# Altium schematic sheet FM349readerV01.SchDoc
size A3
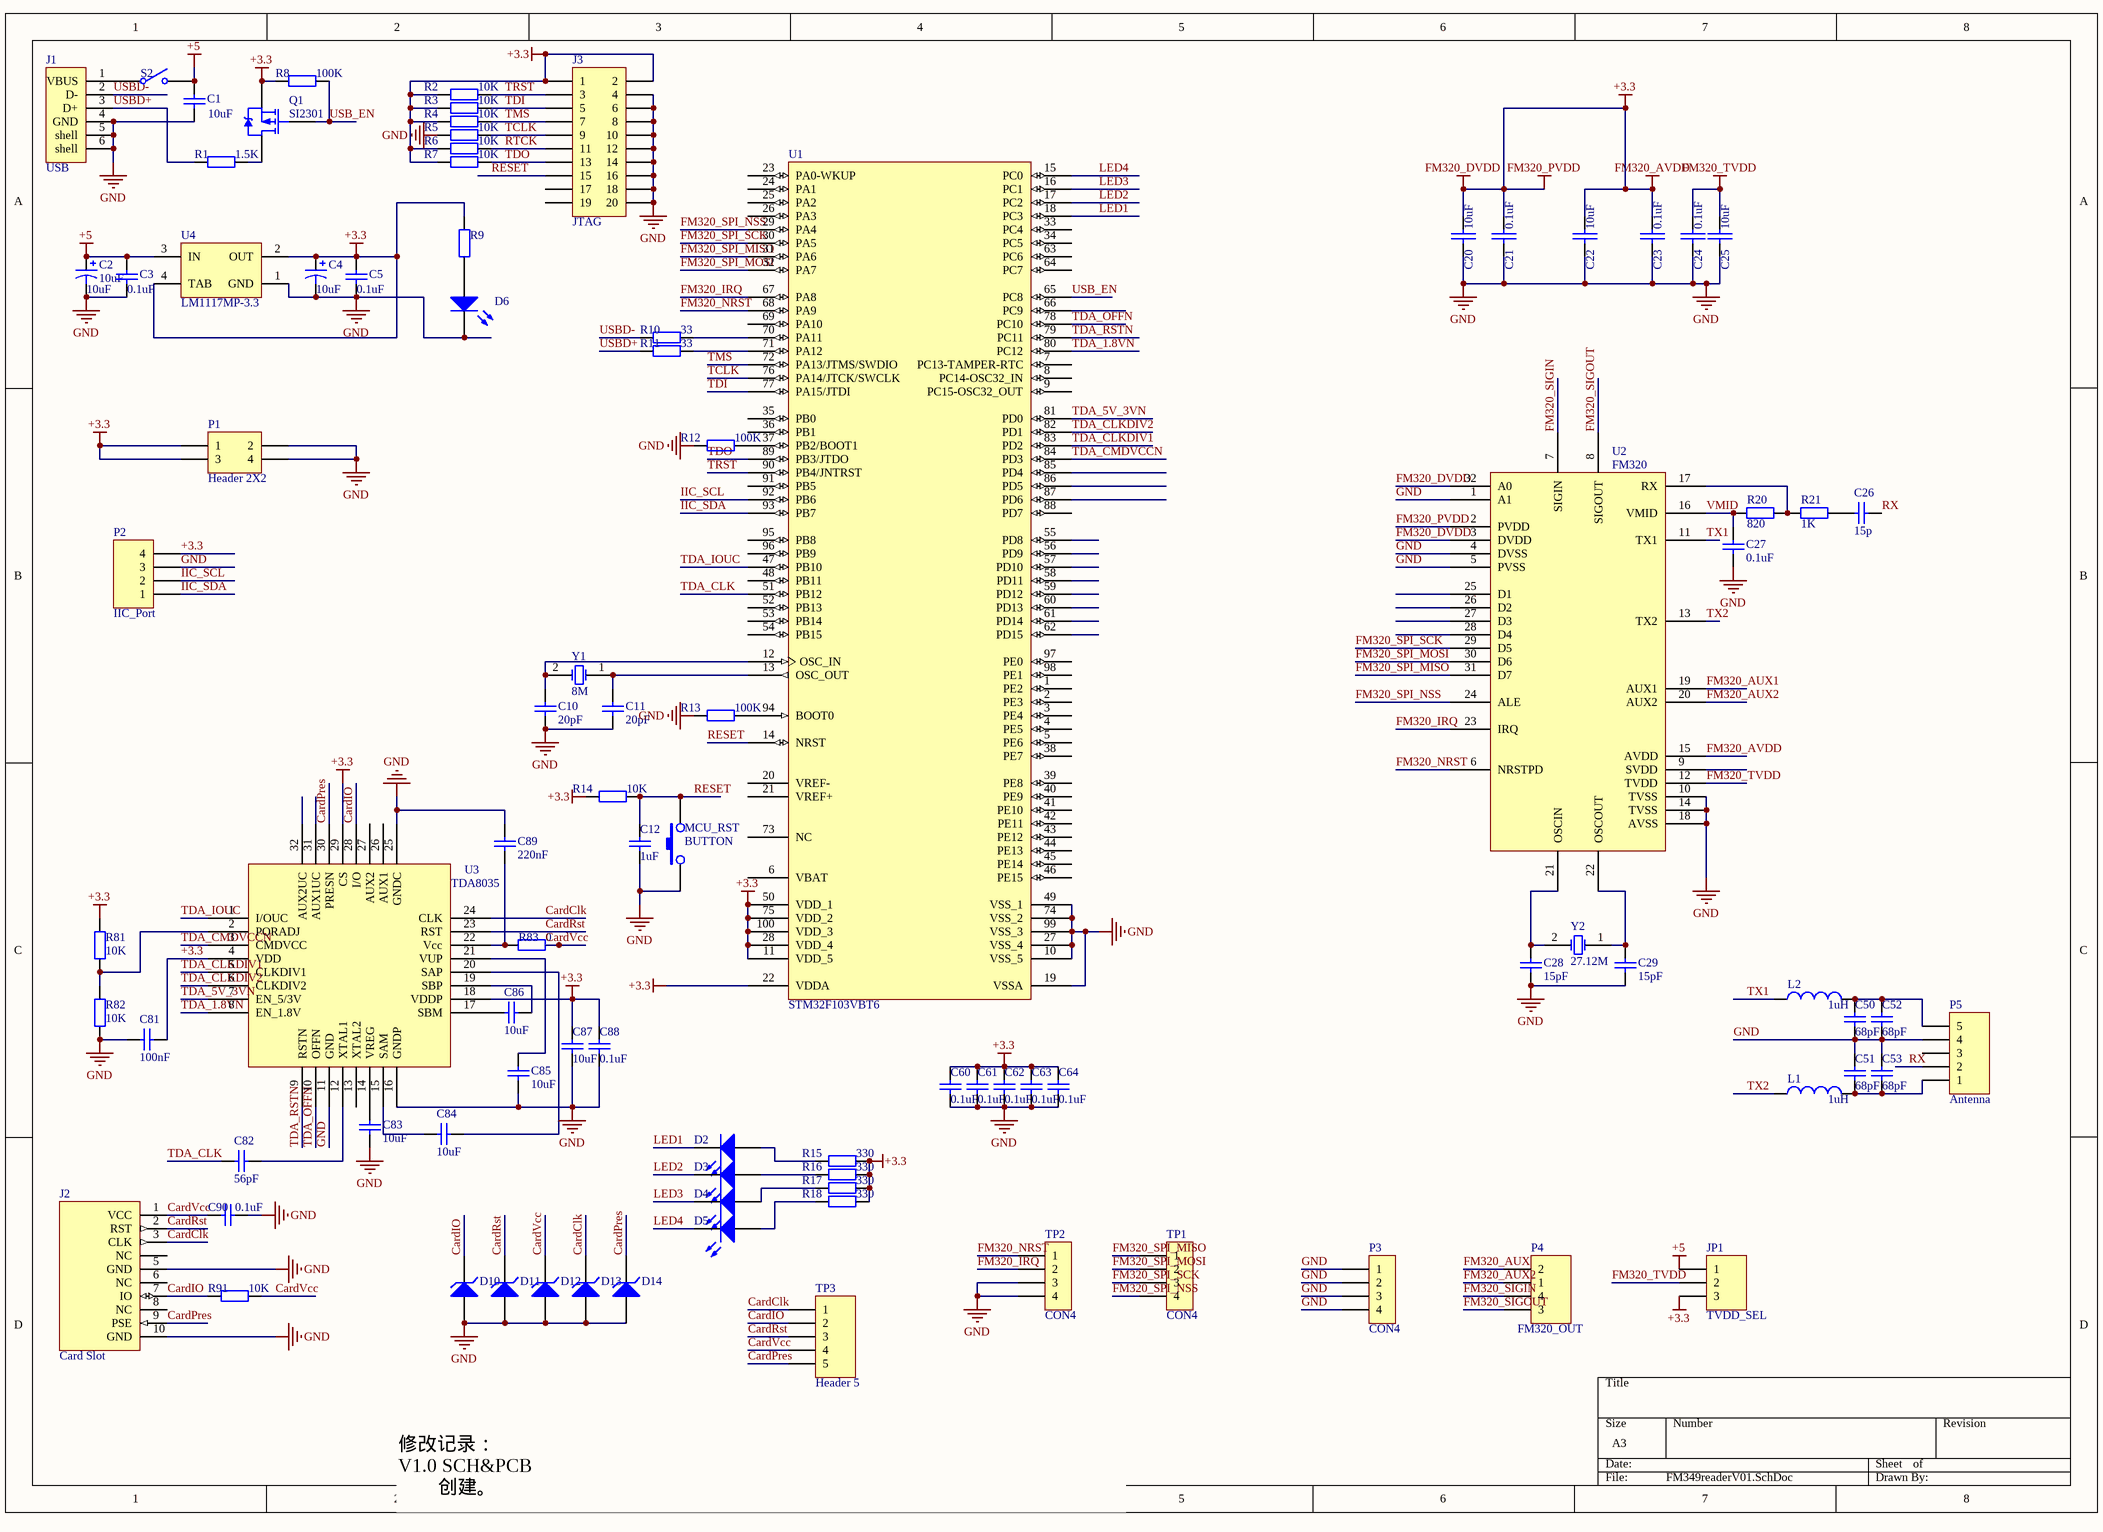
[diagram p0: FM349readerV01.SchDoc]

## Parts
C1  10uF  [0805]
C2  10uF  [0805]
C3  0.1uF  [0805]
C4  10uF  [0805]
C5  0.1uF  [0805]
C10  20pF  [0805]
C11  20pF  [0805]
C12  1uF  [0805]
C20  10uF  [0805]
C21  0.1uF  [0805]
C22  10uF  [0805]
C23  0.1uF  [0805]
C24  0.1uF  [0805]
C25  10uF  [0805]
C26  value 15p  [0805]  (hidden comment: 0.1uF)
C27  0.1uF  [0805]
C28  15pF  [0805]
C29  15pF  [0805]
C50  68pF  [0805]
C51  68pF  [0805]
C52  68pF  [0805]
C53  68pF  [0805]
C60  0.1uF  [0805]
C61  0.1uF  [0805]
C62  0.1uF  [0805]
C63  0.1uF  [0805]
C64  0.1uF  [0805]
C81  value 100nF  [0805]  (hidden comment: 0.1uF)
C82  value 56pF  [0805]  (hidden comment: 0.1uF)
C83  value 10uF  [0805]  (hidden comment: 0.1uF)
C84  value 10uF  [0805]  (hidden comment: 0.1uF)
C85  value 10uF  [0805]  (hidden comment: 0.1uF)
C86  value 10uF  [0805]  (hidden comment: 0.1uF)
C87  value 10uF  [0805]  (hidden comment: 0.1uF)
C88  0.1uF  [0805]
C89  value 220nF  [0805]  (hidden comment: 0.1uF)
C90  0.1uF  [0805]
D2  LED2  [3.2X1.6X1.1]  (value not drawn)
D3  LED2  [3.2X1.6X1.1]  (value not drawn)
D4  LED2  [3.2X1.6X1.1]  (value not drawn)
D5  LED2  [3.2X1.6X1.1]  (value not drawn)
D6  LED2  [3.2X1.6X1.1]  (value not drawn)
D10  ESD  [SOD-323]  (value not drawn)
D11  ESD  [SOD-323]  (value not drawn)
D12  ESD  [SOD-323]  (value not drawn)
D13  ESD  [SOD-323]  (value not drawn)
D14  ESD  [SOD-323]  (value not drawn)
J1  USB  [USB-B]
J2  Card Slot  [BIG-CARD-SLOT]
J3  JTAG  [HDR2X10]
JP1  TVDD_SEL  [HDR1X3]
L1  1uH  [1812]
L2  1uH  [1812]
MCU_RST  BUTTON  [BUTTON-S]
P1  Header 2X2  [HDR2X2]
P2  IIC_Port  [HDR1X4]
P3  CON4  [HDR1X4]
P4  FM320_OUT  [HDR1X4]
P5  Antenna  [HDR1X5]
Q1  SI2301  [SOT-23-2301]
R1  1.5K  [0805]
R2  10K  [0805]
R3  10K  [0805]
R4  10K  [0805]
R5  10K  [0805]
R6  10K  [0805]
R7  10K  [0805]
R8  value 100K  [0805]  (hidden comment: 10K)
R9  1.5K  [0805]  (value not drawn)
R10  33  [0805]
R11  33  [0805]
R12  100K  [0805]
R13  100K  [0805]
R14  10K  [0805]
R15  330  [0805]
R16  330  [0805]
R17  330  [0805]
R18  330  [0805]
R20  820  [0805]
R21  1K  [0805]
R81  value 10K  [0805]  (hidden comment: 1.5K)
R82  value 10K  [0805]  (hidden comment: 1.5K)
R83  value 0  [0805]  (hidden comment: 10K)
R91  value 10K  [0805]  (hidden comment: 1.5K)
S2  SW-SPST  [SW]  (value not drawn)
TP1  CON4  [HDR1X4]
TP2  CON4  [HDR1X4]
TP3  Header 5  [HDR1X5]
U1  STM32F103VBT6  [LQFP100_L]
U2  FM320  [FM320_PIN32]
U3  TDA8035  [TDA8035_PIN32]
U4  LM1117MP-3.3  [MP04A_L]
Y1  8M  [XTAL-0.2]
Y2  27.12M  [XTAL-0.2]

## Nets
+3.3: C4.1 C5.2 C20.2 C21.1 C22.1 C23.1 C60.2 C61.2 C62.2 C63.2 C64.2 C81.1 C87.2 C88.2 J3.1 J3.2 JP1.3 P1.1 P1.3 P2.4 Q1.3(S) R2.1 R3.1 R4.1 R6.1 R7.1 R8.1 R9.2 R14.1 R15.2 R16.1 R17.2 R18.2 R81.2 U1.11(VDD_5) U1.22(VDDA) U1.28(VDD_4) U1.50(VDD_1) U1.75(VDD_2) U1.100(VDD_3) U2.2(PVDD) U2.3(DVDD) U2.15(AVDD) U2.32(A0) U3.4(VDD) U3.18(VDDP) U3.29(CS) U4.2(OUT) U4.4(TAB)  [also labelled FM320_AVDD, FM320_DVDD, FM320_PVDD]
+5: C1.2 C2.1 C3.2 JP1.1 S2.2(NO) U4.3(IN)
FM320_TVDD: C24.1 C25.1 JP1.2 U2.12(TVDD)
GND: C1.1 C2.2 C3.1 C4.2 C5.1 C10.1 C11.1 C12.1 C20.1 C21.2 C22.2 C23.2 C24.2 C25.2 C27.2 C28.1 C29.1 C50.2 C51.1 C52.2 C53.1 C60.1 C61.1 C62.1 C63.1 C64.1 C81.2 C83.2 C85.1 C87.1 C88.1 C89.1 C90.2 D6.2(K) D10.1(A) D11.1(A) D12.1(A) D13.1(A) D14.1(A) J1.4(GND) J1.5(shell) J1.6(shell) J2.5(GND) J2.10(GND) J3.4 J3.6 J3.8 J3.10 J3.12 J3.14 J3.16 J3.18 J3.20 MCU_RST.1 P1.2 P1.4 P2.3 P3.1 P3.2 P3.3 P3.4 P5.4 R5.2 R12.1 R13.1 R82.1 TP2.3 TP2.4 U1.10(VSS_5) U1.19(VSSA) U1.27(VSS_4) U1.49(VSS_1) U1.74(VSS_2) U1.99(VSS_3) U2.1(A1) U2.4(DVSS) U2.5(PVSS) U2.10(TVSS) U2.14(TVSS) U2.18(AVSS) U3.11(GND) U3.16(GNDP) U3.25(GNDC) U4.1(GND)
CardClk: D13.2(K) J2.3(CLK) TP3.1 U3.24(CLK)
CardIO: D10.2(K) J2.7(IO) R91.1 TP3.2 U3.28(I/O)
CardPres: D14.2(K) J2.9(PSE) TP3.5 U3.30(PRESN)
CardRst: D11.2(K) J2.2(RST) TP3.3 U3.23(RST)
CardVcc: C90.1 D12.2(K) J2.1(VCC) R83.2 R91.2 TP3.4
FM320_AUX1: P4.2 U2.19(AUX1)
FM320_AUX2: P4.1 U2.20(AUX2)
FM320_IRQ: TP2.2 U1.67(PA8) U2.23(IRQ)
FM320_NRST: TP2.1 U1.68(PA9) U2.6(NRSTPD)
FM320_SIGIN: P4.4 U2.7(SIGIN)
FM320_SIGOUT: P4.3 U2.8(SIGOUT)
FM320_SPI_MISO: TP1.1 U1.31(PA6) U2.31(D7)
FM320_SPI_MOSI: TP1.2 U1.32(PA7) U2.30(D6)
FM320_SPI_NSS: TP1.4 U1.29(PA4) U2.24(ALE)
FM320_SPI_SCK: TP1.3 U1.30(PA5) U2.29(D5)
IIC_SCL: P2.2 U1.92(PB6)
IIC_SDA: P2.1 U1.93(PB7)
LED1: D2.2(K) U1.18(PC3)
LED2: D3.2(K) U1.17(PC2)
LED3: D4.2(K) U1.16(PC1)
LED4: D5.2(K) U1.15(PC0)
RESET: C12.2 J3.15 MCU_RST.2 R14.2 U1.14(NRST)
RTCK: J3.11 R6.2
RX: C26.1 P5.2
TCLK: J3.9 R5.1 U1.76(PA14/JTCK/SWCLK)
TDA_1.8VN: U1.80(PC12) U3.8(EN_1.8V)
TDA_5V_3VN: U1.81(PD0) U3.7(EN_5/3V)
TDA_CLK: C82.1 U1.51(PB12)
TDA_CLKDIV1: U1.83(PD2) U3.5(CLKDIV1)
TDA_CLKDIV2: U1.82(PD1) U3.6(CLKDIV2)
TDA_CMDVCCN: U1.84(PD3) U3.3(CMDVCC)
TDA_IOUC: U1.47(PB10) U3.1(I/OUC)
TDA_OFFN: U1.78(PC10) U3.10(OFFN)
TDA_RSTN: U1.79(PC11) U3.9(RSTN)
TDI: J3.5 R3.2 U1.77(PA15/JTDI)
TDO: J3.13 R7.2 U1.89(PB3/JTDO)
TMS: J3.7 R4.2 U1.72(PA13/JTMS/SWDIO)
TRST: J3.3 R2.2 U1.90(PB4/JNTRST)
TX1: L2.1 U2.11(TX1)
TX2: L1.1 U2.13(TX2)
USB_EN: Q1.1(G) R8.2 U1.65(PC8)
USBD+: J1.3(D+) R1.1 R11.1
USBD-: J1.2(D-) R10.1
VMID: C27.1 R20.2 U2.16(VMID)
NetC10_2: C10.2 U1.12(OSC_IN) Y1.2(OSC2)
NetC11_2: C11.2 U1.13(OSC_OUT) Y1.1(OSC1)
NetC26_2: C26.2 R21.1
NetC28_2: C28.2 U2.21(OSCIN) Y2.2(OSC2)
NetC29_2: C29.2 U2.22(OSCOUT) Y2.1(OSC1)
NetC50_1: C50.1 C52.1 L2.2 P5.5
NetC51_2: C51.2 C53.2 L1.2 P5.1
NetC82_2: C82.2 U3.12(XTAL1)
NetC83_1: C83.1 U3.14(VREG)
NetC84_1: C84.1 U3.20(SAP)
NetC84_2: C84.2 U3.15(SAM)
NetC85_2: C85.2 U3.21(VUP)
NetC86_1: C86.1 U3.19(SBP)
NetC86_2: C86.2 U3.17(SBM)
NetC89_2: C89.2 R83.1 U3.22(Vcc)
NetD2_1: D2.1(A) R15.1
NetD3_1: D3.1(A) R16.2
NetD4_1: D4.1(A) R17.1
NetD5_1: D5.1(A) R18.1
NetD6_1: D6.1(A) R9.1
NetJ1_1: J1.1(VBUS) S2.1(COMMON)
NetQ1_2: Q1.2(D) R1.2
NetR10_2: R10.2 U1.70(PA11)
NetR11_2: R11.2 U1.71(PA12)
NetR12_2: R12.2 U1.37(PB2/BOOT1)
NetR13_2: R13.2 U1.94(BOOT0)
NetR20_1: R20.1 R21.2 U2.17(RX)
NetR81_1: R81.1 R82.2 U3.2(PORADJ)

Not connected (* = marked no-connect by the designer): J2 4(NC) 6(NC) 8(NC); J3 17 19; P5 3; U1 1(PE2) 2(PE3) 3(PE4) 4(PE5) 5(PE6) 6(VBAT) 7(PC13-TAMPER-RTC) 8(PC14-OSC32_IN) 9(PC15-OSC32_OUT) 20(VREF-) 21(VREF+) 23(PA0-WKUP) 24(PA1) 25(PA2) 26(PA3) 33(PC4) 34(PC5) 35(PB0) 36(PB1) 38(PE7) 39(PE8) 40(PE9) 41(PE10) 42(PE11) 43(PE12) 44(PE13) 45(PE14) 46(PE15) 48(PB11) 52(PB13) 53(PB14) 54(PB15) 55(PD8) 56(PD9) 57(PD10) 58(PD11) 59(PD12) 60(PD13) 61(PD14) 62(PD15) 63(PC6) 64(PC7) 66(PC9) 69(PA10) 73(NC) 85(PD4) 86(PD5) 87(PD6) 88(PD7) 91(PB5) 95(PB8) 96(PB9) 97(PE0) 98(PE1); U2 9(SVDD) 25(D1) 26(D2) 27(D3) 28(D4); U3 13(XTAL2) 26(AUX1) 27(AUX2) 31(AUX1UC) 32(AUX2UC)

## Notes on the sheet
- 修改记录：
  V1.0 SCH&PCB
  创建。

## Library data of the parts
C1 C3 C5 C10-C12 C26-C29 C50-C53 C60-C64 C81-C90 = Cap: Capacitor; Published: 8-Jun-2000; LatestRevisionDate: 17-Jul-2002; LatestRevisionNote: Re-released for DXP Platform.; Publisher: Altium Limited
  C1: PackageReference: 0805; Value: 10uF
  C3 C5 C88: PackageReference: 0805; Value: 0.1uF
  C10 C11: PackageReference: RAD-0.3; Value: 20pF
  C12: PackageReference: RAD-0.3; Value: 1uF
  C26: PackageReference: RAD-0.3
  C27 C60-C64 C90: PackageReference: RAD-0.3; Value: 0.1uF
  C28 C29: PackageReference: RAD-0.3; Value: 15pF
  C50-C53: PackageReference: 0805; Value: 68pF
  C81-C87 C89: PackageReference: 0805
C2 C4 = Cap Pol1: Polarized Capacitor (Radial); Published: 8-Jun-2000; LatestRevisionDate: 17-Jul-2002; LatestRevisionNote: Re-released for DXP Platform.; PackageReference: 0805; Publisher: Altium Limited; Value: 10uF
C20-C25 = CAP: Capacitor
D2-D6 = LED2: Typical RED, GREEN, YELLOW, AMBER GaAs LED; Published: 8-Jun-2000; LatestRevisionDate: 17-Jul-2002; LatestRevisionNote: Re-released for DXP Platform.; PackageDocument: Feb-2002; PackageReference: 3.2X1.6X1.1; Publisher: Altium Limited
D10-D14 = D Zener: Zener Diode; Published: 8-Jun-2000; LatestRevisionDate: 17-Jul-2002; LatestRevisionNote: Re-released for DXP Platform.; PackageReference: DIODE-0.7; Publisher: Altium Limited; PackageDescription: Diode, Thru-Hole; 2 Leads; 0.7 in Pin Spacing
J3 = Header 10X2: Header, 10-Pin, Dual row; LatestRevisionDate: 17-Jul-2002; LatestRevisionNote: Re-released for DXP Platform.; Publisher: Altium Limited
JP1 = Header 3: Header, 3-Pin; LatestRevisionDate: 17-Jul-2002; LatestRevisionNote: Re-released for DXP Platform.; Publisher: Altium Limited
L1 L2 = Inductor: Code_IEC: 1005; Published: 8-Jun-2000; LatestRevisionDate: 17-Jul-2002; LatestRevisionNote: Re-released for DXP Platform.; PackageReference: 1812; Publisher: Altium Limited; Code_JEITA: 0402; Value: 1uH
MCU_RST = BUTTON: 乒乓球按键（压下后接通，松开自动断开），较大按键尺寸12mmX12mm选用BUTTON-L封装，较小尺寸6mmX6mm选用BUTTON-S封装
P1 = Header 2X2: Header, 2-Pin, Dual row; LatestRevisionDate: 17-Jul-2002; LatestRevisionNote: Re-released for DXP Platform.; Publisher: Altium Limited
P2 P4 = Header 4: Header, 4-Pin; LatestRevisionDate: 17-Jul-2002; LatestRevisionNote: Re-released for DXP Platform.; Publisher: Altium Limited
P3 TP1 TP2 = CON4: Connector
P5 TP3 = Header 5: Header, 5-Pin; LatestRevisionDate: 17-Jul-2002; LatestRevisionNote: Re-released for DXP Platform.; Publisher: Altium Limited
Q1 = PMOS-2: P-Channel Power MOSFET; pin to pad: 2>3 3>2; Note: Pin 4 not drawn and electrically connected to Pin 2.; Published: 8-Jun-2000; LatestRevisionDate: 17-Jul-2002; LatestRevisionNote: Re-released for DXP Platform.; DatasheetDocument: PD-9.390D; PackageReference: SOT-23-2301; Publisher: Altium Limited; Code_JEDEC: TO-220-AB; ComponentLink1Description: Manufacturer Link; ComponentLink1URL: http://www.irf.com/
R1-R18 R20 R21 R81-R83 R91 = Res2: Resistor; Published: 8-Jun-2000; LatestRevisionDate: 17-Jul-2002; LatestRevisionNote: Re-released for DXP Platform.; PackageReference: 0805; Publisher: Altium Limited
  R1: Value: 1.5K
  R2-R7 R14: Value: 10K
  R10 R11: Value: 33
  R12 R13: Value: 100K
  R15-R18: Value: 330
  R20: Value: 820
  R21: Value: 1K
S2 = SW-SPST: Single-Pole, Single-Throw Switch; Published: 24-Mar-1999; LatestRevisionDate: 17-Jul-2002; LatestRevisionNote: Re-released for DXP Platform.; PackageReference: SPST-2; Publisher: Altium Limited; PackageDescription: Switch; 2 Leads
U1 = STM32F103VBT6: STM32 ARM-based 32-bit MCU with 64 Kbytes Flash, 100-pin LQFP, Industrial Temperature; Published: 30-May-2008; DatasheetVersion: rev6, Mar-2008; PackageVersion: Mar-2008; PackageReference: LQFP100; Publisher: Altium Limited; PackageDescription: 100-Pin Low-Profile Quad Flat Pack, 14 x 14 mm Body, 0.5 mm Pitch (LQFP100); ComponentLink1Description: Manufacturer Link; ComponentLink1URL: www.st.com/stm32; ComponentLink2Description: Datasheet; ComponentLink2URL: http://www.st.com/stonline/products/literature/ds/13587.pdf
U2 = PN5120A0HN1
U4 = LM1117MP-3.3: 800mA Low-Dropout Linear Regulator; Manufacturer: National Semiconductor; CompType: LDO IC; PackageTopMarking: XYTT*N05A; Published: 27-Nov-2008; DatasheetVersion: Apr-2006; PackageVersion: revB, Apr-2003; PackageReference: MP04A; Publisher: Altium Limited; PackageDescription: Molded SOT-223, 6.50 x 3.56 x 1.6mm Body, 4 Lead, 2.3mm Pitch; PartNumber: LM1117MP-3.3; RoHS: O; PinCount: 4; DigiKeyPartNumber: LM1117MP-3.3CT-ND; Code_JEDEC: TO-261-AA; Code_IPC: SOT223-4; ComponentLink1Description: LM1117 Datasheet; ComponentLink1URL: http://www.national.com/ds/LM/LM1117.pdf; ComponentLink2Description: LM1117 Web Page; ComponentLink2URL: http://www.national.com/pf/LM/LM1117.html; ComponentLink3Description: MP04A Package Page; ComponentLink3URL: http://www.national.com/packaging/folders/mp04a.html
Y1 Y2 = XTAL: Crystal Oscillator; Published: 8-Jun-2000; LatestRevisionDate: 17-Jul-2002; LatestRevisionNote: Re-released for DXP Platform.; PackageReference: XTAL-0.2; Publisher: Altium Limited
J2 = Card Slot: LatestRevisionDate: 17-Jul-2002; LatestRevisionNote: Re-released for DXP Platform.; Publisher: Altium Limited